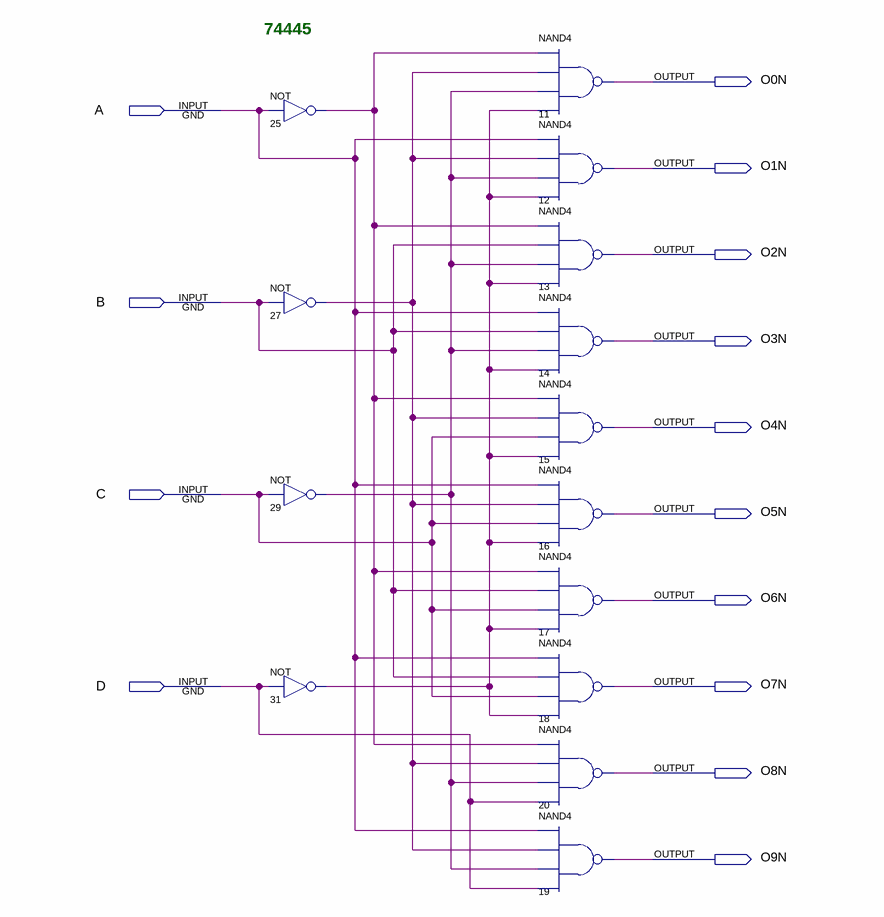
[diagram p0: schematic sheet]
// Quartus schematic 74445.bdf as structural Verilog: 14 symbols, 14 pins
module \74445  (
  input  A,
  input  B,
  input  C,
  input  D,
  output O0N,
  output O1N,
  output O2N,
  output O3N,
  output O4N,
  output O5N,
  output O6N,
  output O7N,
  output O8N,
  output O9N
);

  wire n25_out, n27_out, n29_out, n31_out;

  not u_25 (n25_out, A);
  not u_27 (n27_out, B);
  not u_29 (n29_out, C);
  not u_31 (n31_out, D);
  nand u_11 (O0N, n25_out, n27_out, n29_out, n31_out);
  nand u_12 (O1N, A, n27_out, n29_out, n31_out);
  nand u_13 (O2N, n25_out, B, n29_out, n31_out);
  nand u_14 (O3N, A, B, n29_out, n31_out);
  nand u_15 (O4N, n25_out, n27_out, C, n31_out);
  nand u_16 (O5N, A, n27_out, C, n31_out);
  nand u_17 (O6N, n25_out, B, C, n31_out);
  nand u_18 (O7N, A, B, C, n31_out);
  nand u_20 (O8N, n25_out, n27_out, n29_out, D);
  nand u_19 (O9N, A, n27_out, n29_out, D);

  // Notes on the sheet:
  //   74445
endmodule
